# Altium schematic sheet 模拟部分.SchDoc
size A4
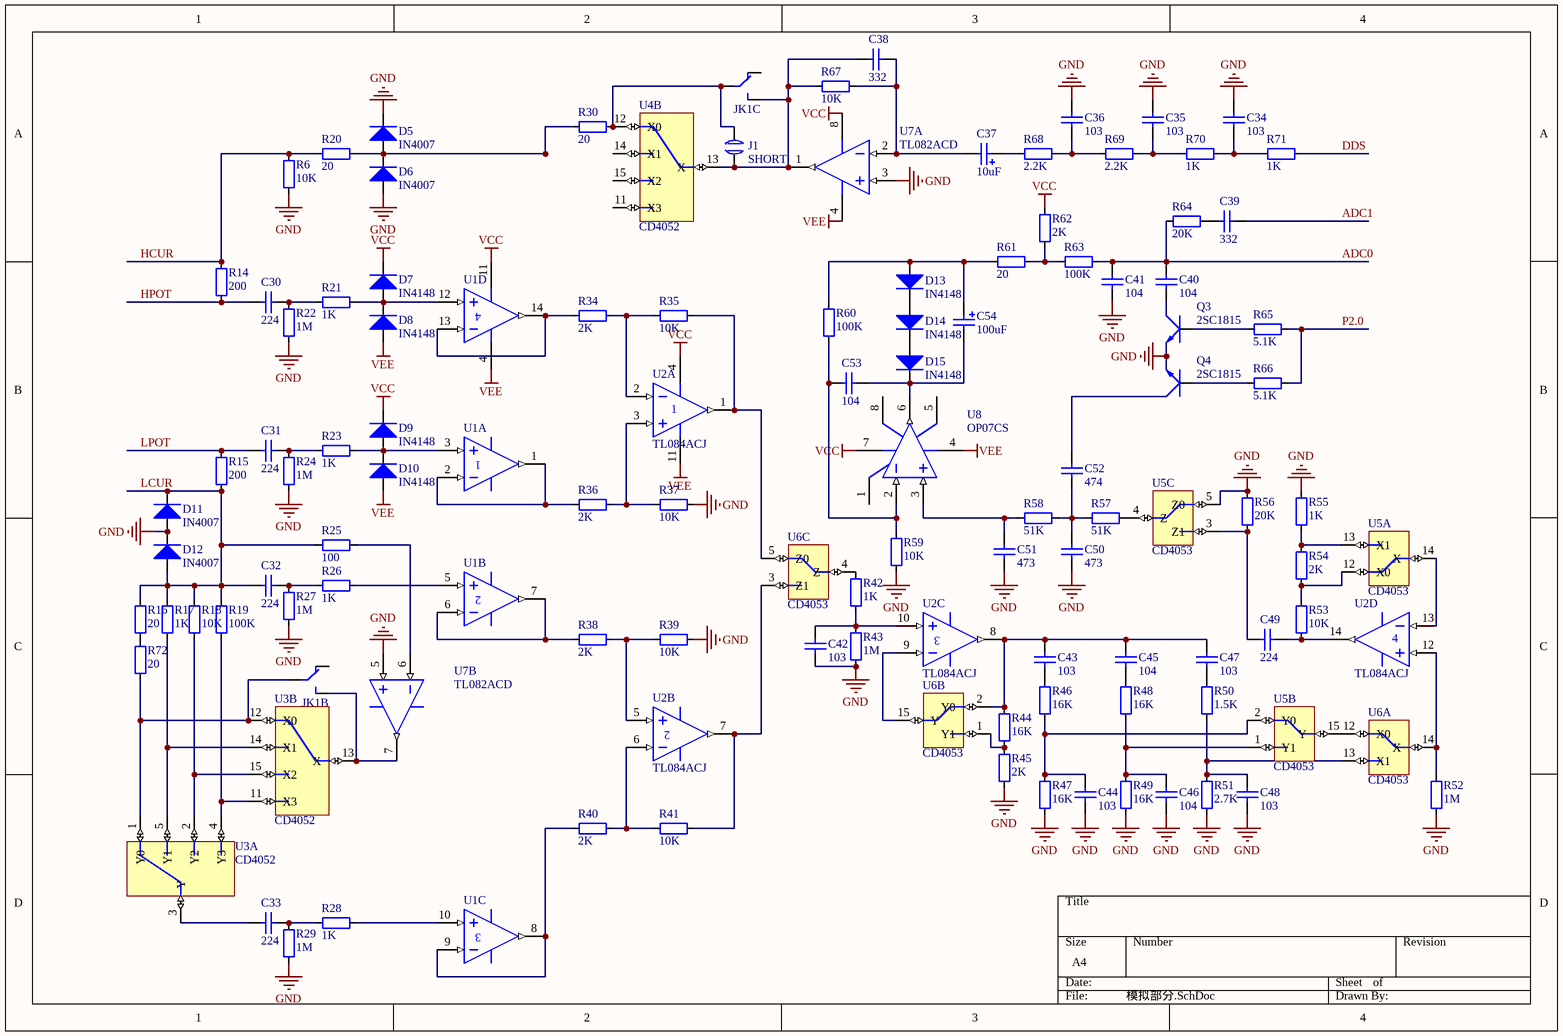
[diagram p0: 模拟部分.SchDoc]

## Parts
C30  value 224  [CL0704]  (hidden comment: CAP)
C31  value 224  [CL0704]  (hidden comment: CAP)
C32  value 224  [CL0704]  (hidden comment: CAP)
C33  value 224  [CL0704]  (hidden comment: CAP)
C34  value 103  [CL0704]  (hidden comment: CAP)
C35  value 103  [CL0704]  (hidden comment: CAP)
C36  value 103  [CL0704]  (hidden comment: CAP)
C37  value 10uF  [CR2]  (hidden comment: CAP POL)
C38  value 332  [CL0704]  (hidden comment: CAP)
C39  value 332  [CL0704]  (hidden comment: CAP)
C40  value 104  [CL0704]  (hidden comment: CAP)
C41  value 104  [CL0704]  (hidden comment: CAP)
C42  value 103  [CL0704]  (hidden comment: CAP)
C43  value 103  [CL0704]  (hidden comment: CAP)
C44  value 103  [CL0704]  (hidden comment: CAP)
C45  value 104  [CL0704]  (hidden comment: CAP)
C46  value 104  [CL0704]  (hidden comment: CAP)
C47  value 103  [CL0704]  (hidden comment: CAP)
C48  value 103  [CL0704]  (hidden comment: CAP)
C49  value 224  [CL0704]  (hidden comment: CAP)
C50  value 473  [CL0704]  (hidden comment: CAP)
C51  value 473  [CL0704]  (hidden comment: CAP)
C52  value 474  [CL0704]  (hidden comment: CAP)
C53  value 104  [CL0704]  (hidden comment: CAP)
C54  value 100uF  [CR3]  (hidden comment: CAP POL)
D5  IN4007  [DO-214]
D6  IN4007  [DO-214]
D7  IN4148  [DO-213AA]
D8  IN4148  [DO-213AA]
D9  IN4148  [DO-213AA]
D10  IN4148  [DO-213AA]
D11  IN4007  [DO-214]
D12  IN4007  [DO-214]
D13  IN4148  [DO-213AA]
D14  IN4148  [DO-213AA]
D15  IN4148  [DO-213AA]
J1  SHORT  [Short]
JK1  JK-2  [JK-G6S2]  (value not drawn)  (parts B,C of 3)
Q3  2SC1815  [TO-92]
Q4  2SC1815  [TO-92]
R6  value 10K  [AXIAL-0.3]  (hidden comment: RES)
R14  value 200  [AXIAL-0.3]  (hidden comment: RES)
R15  value 200  [AXIAL-0.3]  (hidden comment: RES)
R16  value 20  [AXIAL-0.3]  (hidden comment: RES)
R17  value 1K  [AXIAL-0.3]  (hidden comment: RES)
R18  value 10K  [AXIAL-0.3]  (hidden comment: RES)
R19  value 100K  [AXIAL-0.3]  (hidden comment: RES)
R20  value 20  [AXIAL-0.3]  (hidden comment: RES)
R21  value 1K  [AXIAL-0.3]  (hidden comment: RES)
R22  value 1M  [AXIAL-0.3]  (hidden comment: RES)
R23  value 1K  [AXIAL-0.3]  (hidden comment: RES)
R24  value 1M  [AXIAL-0.3]  (hidden comment: RES)
R25  value 100  [AXIAL-0.3]  (hidden comment: RES)
R26  value 1K  [AXIAL-0.3]  (hidden comment: RES)
R27  value 1M  [AXIAL-0.3]  (hidden comment: RES)
R28  value 1K  [AXIAL-0.3]  (hidden comment: RES)
R29  value 1M  [AXIAL-0.3]  (hidden comment: RES)
R30  value 20  [AXIAL-0.3]  (hidden comment: RES)
R34  value 2K  [AXIAL-0.3]  (hidden comment: RES)
R35  value 10K  [AXIAL-0.3]  (hidden comment: RES)
R36  value 2K  [AXIAL-0.3]  (hidden comment: RES)
R37  value 10K  [AXIAL-0.3]  (hidden comment: RES)
R38  value 2K  [AXIAL-0.3]  (hidden comment: RES)
R39  value 10K  [AXIAL-0.3]  (hidden comment: RES)
R40  value 2K  [AXIAL-0.3]  (hidden comment: RES)
R41  value 10K  [AXIAL-0.3]  (hidden comment: RES)
R42  value 1K  [AXIAL-0.3]  (hidden comment: RES)
R43  value 1M  [AXIAL-0.3]  (hidden comment: RES)
R44  value 16K  [AXIAL-0.3]  (hidden comment: RES)
R45  value 2K  [AXIAL-0.3]  (hidden comment: RES)
R46  value 16K  [AXIAL-0.3]  (hidden comment: RES)
R47  value 16K  [AXIAL-0.3]  (hidden comment: RES)
R48  value 16K  [AXIAL-0.3]  (hidden comment: RES)
R49  value 16K  [AXIAL-0.3]  (hidden comment: RES)
R50  value 1.5K  [AXIAL-0.3]  (hidden comment: RES)
R51  value 2.7K  [AXIAL-0.3]  (hidden comment: RES)
R52  value 1M  [AXIAL-0.3]  (hidden comment: RES)
R53  value 10K  [AXIAL-0.3]  (hidden comment: RES)
R54  value 2K  [AXIAL-0.3]  (hidden comment: RES)
R55  value 1K  [AXIAL-0.3]  (hidden comment: RES)
R56  value 20K  [AXIAL-0.3]  (hidden comment: RES)
R57  value 51K  [AXIAL-0.3]  (hidden comment: RES)
R58  value 51K  [AXIAL-0.3]  (hidden comment: RES)
R59  value 10K  [AXIAL-0.3]  (hidden comment: RES)
R60  value 100K  [AXIAL-0.3]  (hidden comment: RES)
R61  value 20  [AXIAL-0.3]  (hidden comment: RES)
R62  value 2K  [AXIAL-0.3]  (hidden comment: RES)
R63  value 100K  [AXIAL-0.3]  (hidden comment: RES)
R64  value 20K  [AXIAL-0.3]  (hidden comment: RES)
R65  value 5.1K  [R0805]  (hidden comment: RES_SMD)
R66  value 5.1K  [R0805]  (hidden comment: RES_SMD)
R67  value 10K  [AXIAL-0.3]  (hidden comment: RES)
R68  value 2.2K  [AXIAL-0.3]  (hidden comment: RES)
R69  value 2.2K  [AXIAL-0.3]  (hidden comment: RES)
R70  value 1K  [AXIAL-0.3]  (hidden comment: RES)
R71  value 1K  [AXIAL-0.3]  (hidden comment: RES)
R72  value 20  [AXIAL-0.3]  (hidden comment: RES)
U1  (no value)  [DIP14]  (parts A,B,C,D of 4)
U2  TL084ACJ  [DIP14]  (parts A,B,C,D of 4)
U3  CD4052  [DIP16]  (parts A,B of 3)
U4  CD4052  [DIP16]  (part B of 3)
U5  CD4053  [DIP16]  (parts A,B,C of 4)
U6  CD4053  [DIP16]  (parts A,B,C of 4)
U7  TL082ACD  [DIP8]  (parts A,B of 2)
U8  OP07CS  [DIP8]

## Nets
GND: C34.1 C35.1 C36.1 C41.1 C42.1 C44.1 C46.1 C48.1 C50.1 C51.1 D5.2 D6.1 D11.1 D12.2 Q3.3 Q4.3 R6.1 R22.1 R24.1 R27.1 R29.1 R37.2 R39.2 R43.1 R45.1 R47.1 R49.1 R51.1 R52.1 R55.2 R56.2 R59.2 U5.5(Z0) U7.3(IN+) U7.5(IN+)
VCC: D7.2 D9.2 R62.1 U1.11(V-) U2.4(V+) U7.8(V+) U8.7(V+)
VEE: D8.1 D10.1 U1.4(V+) U2.11(V-) U7.4(V-) U8.4(V-)
ADC0: C40.2 C41.2 R63.2 R64.1
ADC1: C39.1
DDS: R71.2
HCUR: R6.2 R14.2 R20.1
HPOT: C30.1 R14.1
LCUR: C32.1 D11.2 D12.1 R15.1 R16.2 R17.2 R18.2 R19.2 R25.1
LPOT: C31.1 R15.2
P2.0: R65.2 R66.2
NetC30_2: C30.2 R21.2 R22.2
NetC31_2: C31.2 R23.1 R24.2
NetC32_2: C32.2 R26.1 R27.2
NetC33_1: C33.1 U3.3(Y)
NetC33_2: C33.2 R28.1 R29.2
NetC34_2: C34.2 R70.2 R71.1
NetC35_2: C35.2 R69.2 R70.1
NetC36_2: C36.2 R68.2 R69.1
NetC37_1: C37.1 R68.1
NetC37_2: C37.2 C38.1 R67.2 U7.2(IN-)
NetC38_2: C38.2 J1.1 JK1.5 R67.1 U4.13(X) U7.1(OUT)
NetC39_2: C39.2 R64.2
NetC40_1: C40.1 Q3.2
NetC42_2: C42.2 R42.1 R43.2 U2.10(IN+)
NetC43_1: C43.1 R46.2
NetC43_2: C43.2 C45.2 C47.2 R44.2 U2.8(OUT) U6.2(Y0)
NetC44_2: C44.2 R46.1 R47.2 U5.2(Y0)
NetC45_1: C45.1 R48.2
NetC46_2: C46.2 R48.1 R49.2 U5.1(Y1)
NetC47_1: C47.1 R50.2
NetC48_2: C48.2 R50.1 R51.2 U6.13(X1)
NetC49_1: C49.1 R56.1 U5.3(Z1)
NetC49_2: C49.2 R53.1 U2.14(OUT)
NetC50_2: C50.2 C52.1 R57.2 R58.1
NetC51_2: C51.2 R58.2 U8.3(IN+)
NetC52_2: C52.2 Q4.2
NetC53_1: C53.1 C54.2 D15.2 U8.6(OUT)
NetC53_2: C53.2 R59.1 R60.2 U8.2(IN-)
NetC54_1: C54.1 D13.1 R60.1 R61.1
NetD5_1: D5.1 D6.2 R20.2 R30.1
NetD7_1: D7.1 D8.2 R21.1 U1.12(IN+)
NetD9_1: D9.1 D10.2 R23.2 U1.3(IN+)
NetD13_2: D13.2 D14.1
NetD14_2: D14.2 D15.1
NetJ1_2: J1.2 JK1.6 R30.2 U4.12(X0)
NetJK1_3: JK1.3 R72.1 U3.1(Y0) U3.12(X0)
NetJK1_4: JK1.4 U3.13(X) U7.7(OUT)
NetQ3_1: Q3.1 R65.1
NetQ4_1: Q4.1 R66.1
NetR16_1: R16.1 R72.2
NetR17_1: R17.1 U3.5(Y1) U3.14(X1)
NetR18_1: R18.1 U3.2(Y2) U3.15(X2)
NetR19_1: R19.1 U3.4(Y3) U3.11(X3)
NetR25_2: R25.2 U7.6(IN-)
NetR26_2: R26.2 U1.5(IN+)
NetR28_2: R28.2 U1.10(IN+)
NetR34_1: R34.1 U1.13(IN-) U1.14(OUT)
NetR34_2: R34.2 R35.1 U2.2(IN-)
NetR35_2: R35.2 U2.1(OUT) U6.5(Z0)
NetR36_1: R36.1 U1.1(OUT) U1.2(IN-)
NetR36_2: R36.2 R37.1 U2.3(IN+)
NetR38_1: R38.1 U1.6(IN-) U1.7(OUT)
NetR38_2: R38.2 R39.1 U2.5(IN+)
NetR40_1: R40.1 U1.8(OUT) U1.9(IN-)
NetR40_2: R40.2 R41.1 U2.6(IN-)
NetR41_2: R41.2 U2.7(OUT) U6.3(Z1)
NetR42_2: R42.2 U6.4(Z)
NetR44_1: R44.1 R45.2 U6.1(Y1)
NetR52_2: R52.2 U2.12(IN+) U6.14(X)
NetR53_2: R53.2 R54.1 U5.12(X0)
NetR54_2: R54.2 R55.1 U5.13(X1)
NetR57_1: R57.1 U5.4(Z)
NetR61_2: R61.2 R62.2 R63.1
NetU2_9: U2.9(IN-) U6.15(Y)
NetU2_13: U2.13(IN-) U5.14(X)
NetU5_15: U5.15(Y) U6.12(X0)

Not connected (* = marked no-connect by the designer): JK1 2 7; U4 11(X3) 14(X1) 15(X2); U8 1(VOSTRIM) 5(NC) 8(VOSTRIM)

## Library data of the parts
C30-C36 C38-C53 = CAP: 插脚无极电容
C37 C54 = CAP POL: 插脚有极电容
J1 = SHORT: 焊接型跳线
JK1 = JK-2: 小型双刀双掷继电器
Q3 Q4 = 2SC1815: 低压小功率NPN管(0,15A/50V/0.4W)
R6 R14-R30 R34-R64 R67-R72 = RES: 插脚电阻
R65 R66 = RES_SMD: 贴片电阻
U1 U2 = TL084ACJ: JFET-Input Operational Amplifier; Published: 17-Jul-2002; LatestRevisionDate: 06-Jun-2005; LatestRevisionNote: Stylized 3D Model Added.; DatasheetVersion: 1988; PackageReference: 632-08; Publisher: Altium Limited; PackageDescription: DIP; 14 Leads; Row Spacing 7.62 mm; Pitch 2.54 mm; ComponentLink1Description: Manufacturer Link; ComponentLink1URL: http://www.onsemi.com/site/products/parametrics/0,4446,251,00.html
U7 = TL082ACD: JFET-Input Operational Amplifier; Published: 17-Jul-2002; LatestRevisionDate: 13-Apr-2006; LatestRevisionNote: IPC-7351 Footprint Added.; DatasheetVersion: 1988; PackageReference: 751-02; Publisher: Altium Limited; PackageDescription: 8-Pin Small Outline Integrated Circuit 1.27 mm Pitch; Code_JEDEC: MS-012-AA; Code_IPC: SOIC127P600-8; ComponentLink1Description: Manufacturer Link; ComponentLink1URL: http://www.onsemi.com/site/products/parametrics/0,4446,251,00.html
U8 = OP07CS: Ultra-Low Offset Voltage Operational Amplifier; Note: Pin 5 is not connected.; Published: 8-Jun-2000; LatestRevisionDate: 13-Apr-2006; LatestRevisionNote: IPC-7351 Footprint Added.; DatasheetVersion: 1992; PackageVersion: revA; PackageReference: SO-8; Publisher: Altium Limited; PackageDescription: 8-Pin Small Outline Integrated Circuit 1.27 mm Pitch; Code_JEDEC: MS-012-AA; Code_IPC: SOIC127P600-8; ComponentLink1Description: Manufacturer Link; ComponentLink1URL: http://www.analog.com/en/prod/0,,759_786_OP07%2C00.html; ComponentLink2Description: Datasheet; ComponentLink2URL: http://www.analog.com/UploadedFiles/Data_Sheets/39161232478959OP07_c.pdf